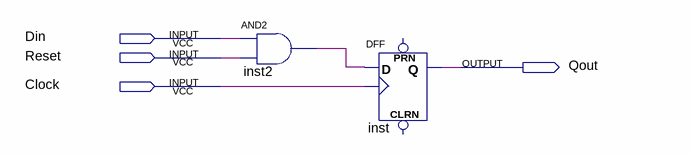
[diagram p0: schematic sheet]
// Quartus schematic week4_ex1_2.bdf as structural Verilog: 2 symbols, 4 pins
module week4_ex1_2 (
  input  Din,
  input  Reset,
  input  Clock,
  output Qout
);

  wire inst2_out;

  and inst2 (inst2_out, Din, Reset);
  DFF inst (.CLK(Clock), .D(inst2_out), .Q(Qout));  // open: CLRN, PRN
endmodule
